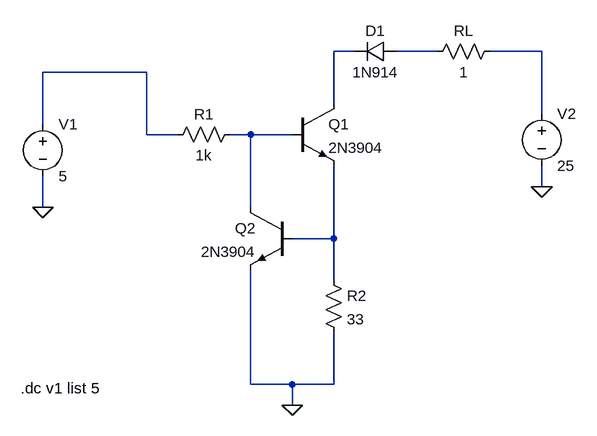
[diagram p0: schematic Current_Limiting_Circuit V1.asc]
Current_Limiting_Circuit V1.asc, the LTspice schematic file:
Version 4
SHEET 1 1304 868
WIRE 960 304 928 304
WIRE 1088 304 1024 304
WIRE 1248 304 1168 304
WIRE 640 336 480 336
WIRE 928 384 928 304
WIRE 1248 400 1248 304
WIRE 480 416 480 336
WIRE 640 432 640 336
WIRE 688 432 640 432
WIRE 800 432 768 432
WIRE 864 432 800 432
WIRE 1248 512 1248 480
WIRE 480 544 480 496
WIRE 800 544 800 432
WIRE 928 592 928 480
WIRE 928 592 864 592
WIRE 928 656 928 592
WIRE 800 816 800 640
WIRE 864 816 800 816
WIRE 928 816 928 736
WIRE 928 816 864 816
WIRE 864 848 864 816
FLAG 480 544 0
FLAG 1248 512 0
FLAG 864 848 0
SYMBOL voltage 480 400 R0
WINDOW 123 0 0 Left 0
WINDOW 39 0 0 Left 0
SYMATTR InstName V1
SYMATTR Value 5
SYMBOL res 784 416 R90
WINDOW 0 0 56 VBottom 2
WINDOW 3 32 56 VTop 2
SYMATTR InstName R1
SYMATTR Value 1k
SYMBOL npn 864 384 R0
SYMATTR InstName Q1
SYMATTR Value 2N3904
SYMBOL res 912 640 R0
SYMATTR InstName R2
SYMATTR Value 33
SYMBOL voltage 1248 384 R0
WINDOW 123 0 0 Left 0
WINDOW 39 0 0 Left 0
SYMATTR InstName V2
SYMATTR Value 25
SYMBOL npn 864 544 M0
SYMATTR InstName Q2
SYMATTR Value 2N3904
SYMBOL diode 1024 288 R90
WINDOW 0 0 32 VBottom 2
WINDOW 3 32 32 VTop 2
SYMATTR InstName D1
SYMATTR Value 1N914
SYMBOL res 1184 288 R90
WINDOW 0 0 56 VBottom 2
WINDOW 3 32 56 VTop 2
SYMATTR InstName RL
SYMATTR Value 1
TEXT 446 822 Left 2 !.dc v1 list 5

The netlist it stands for:
* Current_Limiting_Circuit V1.asc
V1 N004 0 5
R1 N005 N004 1k
Q1 N001 N005 N006 0 2N3904
R2 N006 0 33
V2 N003 0 25
Q2 N005 N006 0 0 2N3904
D1 N002 N001 1N914
RL N003 N002 1
.model D D
.lib standard.dio
.model NPN NPN
.model PNP PNP
.lib standard.bjt
.dc v1 list 5
.backanno
.end